# Altium schematic sheet Fibre-Optic-Interface_main.SchDoc
size A4; SheetNumber: 1; SheetTotal: 4
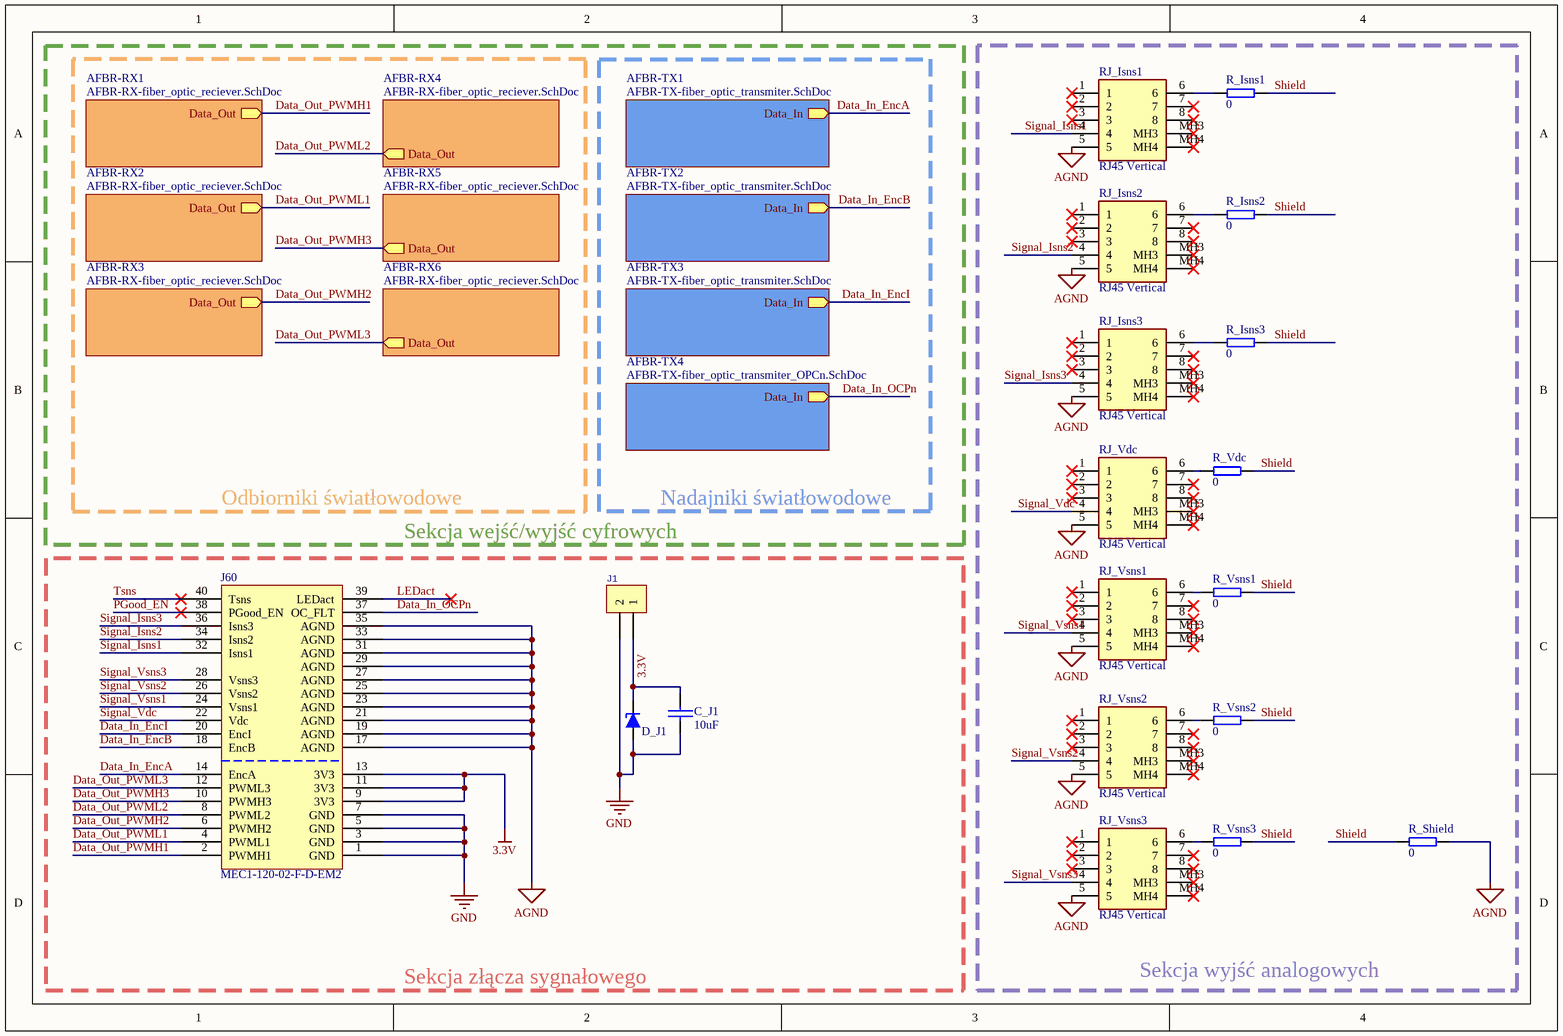
[diagram p0: Fibre-Optic-Interface_main.SchDoc]

## Parts
C_J1  10uF  [0603C]
D_J1  DIODE_ZENER  [Mini MELF - D]  (value not drawn)
J1  Header_2  [TBG2-3.5MM_H]  (value not drawn)
J60  MEC1-120-02-F-D-EM2  [J60_Connector]
R_Isns1  0  [0603R]
R_Isns2  0  [0603R]
R_Isns3  0  [0603R]
R_Shield  0  [0603R]
R_Vdc  0  [0603R]
R_Vsns1  0  [0603R]
R_Vsns2  0  [0603R]
R_Vsns3  0  [0603R]
RJ_Isns1  RJ45 Vertical  [CUC-SP-J1ST-S/R4LT]
RJ_Isns2  RJ45 Vertical  [CUC-SP-J1ST-S/R4LT]
RJ_Isns3  RJ45 Vertical  [CUC-SP-J1ST-S/R4LT]
RJ_Vdc  RJ45 Vertical  [CUC-SP-J1ST-S/R4LT]
RJ_Vsns1  RJ45 Vertical  [CUC-SP-J1ST-S/R4LT]
RJ_Vsns2  RJ45 Vertical  [CUC-SP-J1ST-S/R4LT]
RJ_Vsns3  RJ45 Vertical  [CUC-SP-J1ST-S/R4LT]

## Blocks framed on the sheet
Sekcja wyjść analogowych: R_Isns1-R_Isns3 R_Shield R_Vdc R_Vsns1-R_Vsns3 RJ_Isns1-RJ_Isns3 RJ_Vdc RJ_Vsns1-RJ_Vsns3

## Sub-sheets
AFBR-RX1 = AFBR-RX-fiber_optic_reciever.SchDoc: Data_Out (out)
AFBR-RX2 = AFBR-RX-fiber_optic_reciever.SchDoc: Data_Out (out)
AFBR-RX3 = AFBR-RX-fiber_optic_reciever.SchDoc: Data_Out (out)
AFBR-RX4 = AFBR-RX-fiber_optic_reciever.SchDoc: Data_Out (out)
AFBR-RX5 = AFBR-RX-fiber_optic_reciever.SchDoc: Data_Out (out)
AFBR-RX6 = AFBR-RX-fiber_optic_reciever.SchDoc: Data_Out (out)
AFBR-TX1 = AFBR-TX-fiber_optic_transmiter.SchDoc: Data_In (out)
AFBR-TX2 = AFBR-TX-fiber_optic_transmiter.SchDoc: Data_In (out)
AFBR-TX3 = AFBR-TX-fiber_optic_transmiter.SchDoc: Data_In (out)
AFBR-TX4 = AFBR-TX-fiber_optic_transmiter_OPCn.SchDoc: Data_In (out)

## Nets
3.3V: C_J1.1 D_J1.K J1.1 J60.9(3V3) J60.11(3V3) J60.13(3V3)
AGND: J60.17(AGND) J60.19(AGND) J60.21(AGND) J60.23(AGND) J60.25(AGND) J60.27(AGND) J60.29(AGND) J60.31(AGND) J60.33(AGND) J60.35(AGND) R_Shield.2 RJ_Isns1.5 RJ_Isns2.5 RJ_Isns3.5 RJ_Vdc.5 RJ_Vsns1.5 RJ_Vsns2.5 RJ_Vsns3.5
GND: C_J1.2 D_J1.A J1.2 J60.1(GND) J60.3(GND) J60.5(GND) J60.7(GND)
Data_In_EncA: J60.14(EncA) ; sheet AFBR-TX1/Data_In
Data_In_EncB: J60.18(EncB) ; sheet AFBR-TX2/Data_In
Data_In_EncI: J60.20(EncI) ; sheet AFBR-TX3/Data_In
Data_In_OCPn: J60.37(OC_FLT) ; sheet AFBR-TX4/Data_In
Data_Out_PWMH1: J60.2(PWMH1) ; sheet AFBR-RX1/Data_Out
Data_Out_PWMH2: J60.6(PWMH2) ; sheet AFBR-RX3/Data_Out
Data_Out_PWMH3: J60.10(PWMH3) ; sheet AFBR-RX5/Data_Out
Data_Out_PWML1: J60.4(PWML1) ; sheet AFBR-RX2/Data_Out
Data_Out_PWML2: J60.8(PWML2) ; sheet AFBR-RX4/Data_Out
Data_Out_PWML3: J60.12(PWML3) ; sheet AFBR-RX6/Data_Out
LEDact: J60.39(LEDact)
PGood_EN: J60.38(PGood_EN)
Shield: R_Isns1.2 R_Isns2.2 R_Isns3.2 R_Shield.1 R_Vdc.2 R_Vsns1.2 R_Vsns2.2 R_Vsns3.2
Signal_Isns1: J60.32(Isns1) RJ_Isns1.4
Signal_Isns2: J60.34(Isns2) RJ_Isns2.4
Signal_Isns3: J60.36(Isns3) RJ_Isns3.4
Signal_Vdc: J60.22(Vdc) RJ_Vdc.4
Signal_Vsns1: J60.24(Vsns1) RJ_Vsns1.4
Signal_Vsns2: J60.26(Vsns2) RJ_Vsns2.4
Signal_Vsns3: J60.28(Vsns3) RJ_Vsns3.4
Tsns: J60.40(Tsns)
NetR_Isns1_1: R_Isns1.1 RJ_Isns1.6
NetR_Isns2_1: R_Isns2.1 RJ_Isns2.6
NetR_Isns3_1: R_Isns3.1 RJ_Isns3.6
NetR_Vdc_1: R_Vdc.1 RJ_Vdc.6
NetR_Vsns1_1: R_Vsns1.1 RJ_Vsns1.6
NetR_Vsns2_1: R_Vsns2.1 RJ_Vsns2.6
NetR_Vsns3_1: R_Vsns3.1 RJ_Vsns3.6

Not connected (* = marked no-connect by the designer): RJ_Isns1 1* 2* 3* 7* 8* MH3* MH4*; RJ_Isns2 1* 2* 3* 7* 8* MH3* MH4*; RJ_Isns3 1* 2* 3* 7* 8* MH3* MH4*; RJ_Vdc 1* 2* 3* 7* 8* MH3* MH4*; RJ_Vsns1 1* 2* 3* 7* 8* MH3* MH4*; RJ_Vsns2 1* 2* 3* 7* 8* MH3* MH4*; RJ_Vsns3 1* 2* 3* 7* 8* MH3* MH4*

## Notes on the sheet
- Odbiorniki światłowodowe
- Nadajniki światłowodowe
- Sekcja wejść/wyjść cyfrowych
- Sekcja złącza sygnałowego

## Library data of the parts
C_J1 = C_1: Capacitor
J60 = Control interface connector: Connector J60
R_Isns1-R_Isns3 R_Shield R_Vdc R_Vsns1-R_Vsns3 = R
RJ_Isns1-RJ_Isns3 RJ_Vdc RJ_Vsns1-RJ_Vsns3 = CUC-SP-J1ST-S/R4LT
J1 = Header_2: PartNumber: *